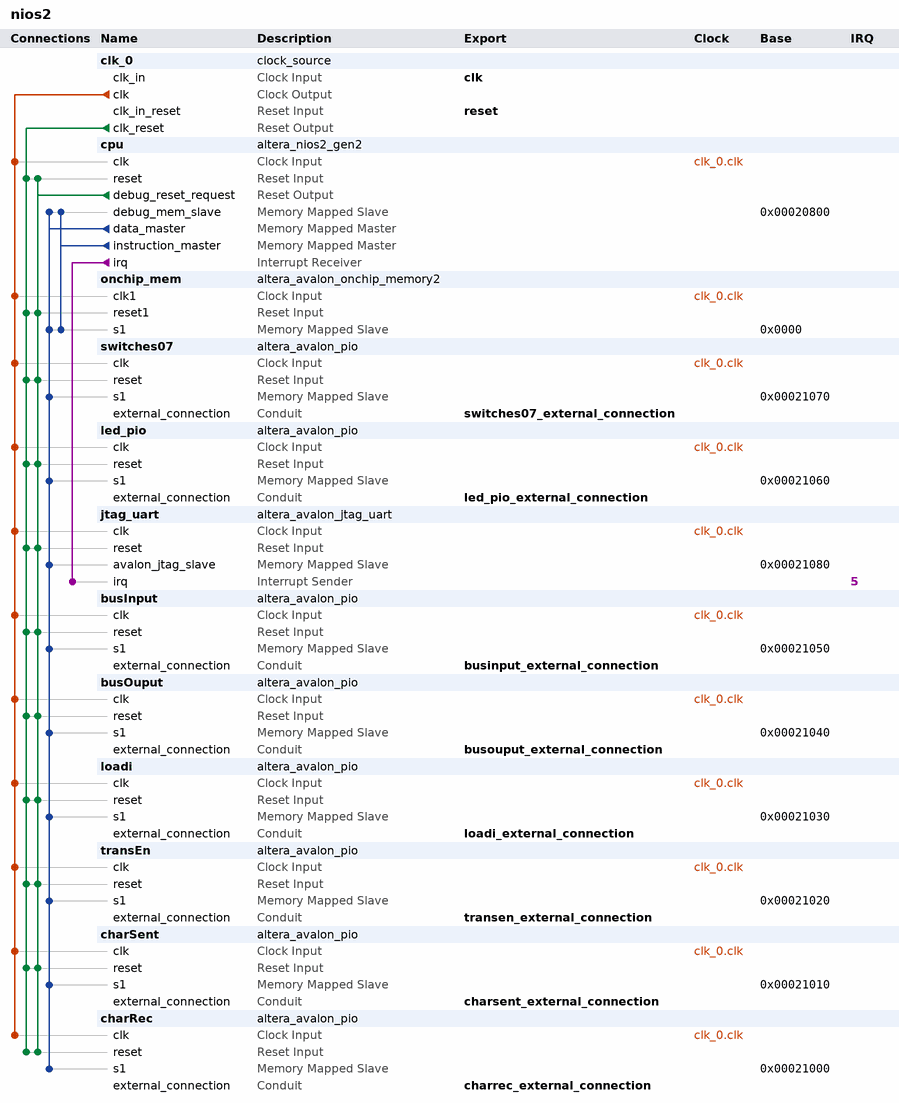
[diagram p0: system contents]
# Platform Designer (Qsys) system nios2, Cyclone V 5CSEMA5F31C6
# Parameters at their usual value, and those the tool derives, are not listed.
package require -exact qsys 17.1
create_system nios2
set_project_property DEVICE_FAMILY {Cyclone V}
set_project_property DEVICE 5CSEMA5F31C6

add_instance clk_0 clock_source 17.1
set_instance_parameter_value clk_0 clockFrequency 50000000

add_instance cpu altera_nios2_gen2 17.1
set_instance_parameter_value cpu dcache_size 2048
set_instance_parameter_value cpu exceptionSlave onchip_mem.s1
set_instance_parameter_value cpu icache_size 2048
set_instance_parameter_value cpu impl Tiny
set_instance_parameter_value cpu resetSlave onchip_mem.s1
set_instance_parameter_value cpu setting_activateTrace true

add_instance onchip_mem altera_avalon_onchip_memory2 17.1
set_instance_parameter_value onchip_mem dataWidth 32
set_instance_parameter_value onchip_mem dualPort false
set_instance_parameter_value onchip_mem initMemContent true
set_instance_parameter_value onchip_mem initializationFileName onchip_mem.hex
set_instance_parameter_value onchip_mem memorySize 100000

add_instance switches07 altera_avalon_pio 17.1
set_instance_parameter_value switches07 direction Input
set_instance_parameter_value switches07 width 8

add_instance led_pio altera_avalon_pio 17.1
set_instance_parameter_value led_pio direction Output
set_instance_parameter_value led_pio width 8

add_instance jtag_uart altera_avalon_jtag_uart 17.1
set_instance_parameter_value jtag_uart simInteractiveOptions NO_INTERACTIVE_WINDOWS

add_instance busInput altera_avalon_pio 17.1
set_instance_parameter_value busInput direction Input
set_instance_parameter_value busInput width 8

add_instance busOuput altera_avalon_pio 17.1
set_instance_parameter_value busOuput direction Output
set_instance_parameter_value busOuput width 8

add_instance loadi altera_avalon_pio 17.1
set_instance_parameter_value loadi direction Output
set_instance_parameter_value loadi width 1

add_instance transEn altera_avalon_pio 17.1
set_instance_parameter_value transEn direction Output
set_instance_parameter_value transEn width 1

add_instance charSent altera_avalon_pio 17.1
set_instance_parameter_value charSent direction Input
set_instance_parameter_value charSent width 1

add_instance charRec altera_avalon_pio 17.1
set_instance_parameter_value charRec direction Input
set_instance_parameter_value charRec width 1

# connections
add_connection clk_0.clk busInput.clk clock
add_connection clk_0.clk busOuput.clk clock
add_connection clk_0.clk charRec.clk clock
add_connection clk_0.clk charSent.clk clock
add_connection clk_0.clk cpu.clk clock
add_connection clk_0.clk jtag_uart.clk clock
add_connection clk_0.clk led_pio.clk clock
add_connection clk_0.clk loadi.clk clock
add_connection clk_0.clk onchip_mem.clk1 clock
add_connection clk_0.clk switches07.clk clock
add_connection clk_0.clk transEn.clk clock
add_connection clk_0.clk_reset busInput.reset reset
add_connection clk_0.clk_reset busOuput.reset reset
add_connection clk_0.clk_reset charRec.reset reset
add_connection clk_0.clk_reset charSent.reset reset
add_connection clk_0.clk_reset cpu.reset reset
add_connection clk_0.clk_reset jtag_uart.reset reset
add_connection clk_0.clk_reset led_pio.reset reset
add_connection clk_0.clk_reset loadi.reset reset
add_connection clk_0.clk_reset onchip_mem.reset1 reset
add_connection clk_0.clk_reset switches07.reset reset
add_connection clk_0.clk_reset transEn.reset reset
add_connection cpu.debug_reset_request busInput.reset reset
add_connection cpu.debug_reset_request busOuput.reset reset
add_connection cpu.debug_reset_request charRec.reset reset
add_connection cpu.debug_reset_request charSent.reset reset
add_connection cpu.debug_reset_request cpu.reset reset
add_connection cpu.debug_reset_request jtag_uart.reset reset
add_connection cpu.debug_reset_request led_pio.reset reset
add_connection cpu.debug_reset_request loadi.reset reset
add_connection cpu.debug_reset_request onchip_mem.reset1 reset
add_connection cpu.debug_reset_request switches07.reset reset
add_connection cpu.debug_reset_request transEn.reset reset
add_connection cpu.data_master busInput.s1 avalon
set_connection_parameter_value cpu.data_master/busInput.s1 baseAddress 0x00021050
add_connection cpu.data_master busOuput.s1 avalon
set_connection_parameter_value cpu.data_master/busOuput.s1 baseAddress 0x00021040
add_connection cpu.data_master charRec.s1 avalon
set_connection_parameter_value cpu.data_master/charRec.s1 baseAddress 0x00021000
add_connection cpu.data_master charSent.s1 avalon
set_connection_parameter_value cpu.data_master/charSent.s1 baseAddress 0x00021010
add_connection cpu.data_master cpu.debug_mem_slave avalon
set_connection_parameter_value cpu.data_master/cpu.debug_mem_slave baseAddress 0x00020800
add_connection cpu.data_master jtag_uart.avalon_jtag_slave avalon
set_connection_parameter_value cpu.data_master/jtag_uart.avalon_jtag_slave baseAddress 0x00021080
add_connection cpu.data_master led_pio.s1 avalon
set_connection_parameter_value cpu.data_master/led_pio.s1 baseAddress 0x00021060
add_connection cpu.data_master loadi.s1 avalon
set_connection_parameter_value cpu.data_master/loadi.s1 baseAddress 0x00021030
add_connection cpu.data_master onchip_mem.s1 avalon
set_connection_parameter_value cpu.data_master/onchip_mem.s1 baseAddress 0x0000
add_connection cpu.data_master switches07.s1 avalon
set_connection_parameter_value cpu.data_master/switches07.s1 baseAddress 0x00021070
add_connection cpu.data_master transEn.s1 avalon
set_connection_parameter_value cpu.data_master/transEn.s1 baseAddress 0x00021020
add_connection cpu.instruction_master cpu.debug_mem_slave avalon
set_connection_parameter_value cpu.instruction_master/cpu.debug_mem_slave baseAddress 0x00020800
add_connection cpu.instruction_master onchip_mem.s1 avalon
set_connection_parameter_value cpu.instruction_master/onchip_mem.s1 baseAddress 0x0000
add_connection cpu.irq jtag_uart.irq interrupt
set_connection_parameter_value cpu.irq/jtag_uart.irq irqNumber 5

# exported interfaces
add_interface businput_external_connection conduit end
set_interface_property businput_external_connection EXPORT_OF busInput.external_connection
add_interface busouput_external_connection conduit end
set_interface_property busouput_external_connection EXPORT_OF busOuput.external_connection
add_interface charrec_external_connection conduit end
set_interface_property charrec_external_connection EXPORT_OF charRec.external_connection
add_interface charsent_external_connection conduit end
set_interface_property charsent_external_connection EXPORT_OF charSent.external_connection
add_interface clk clock sink
set_interface_property clk EXPORT_OF clk_0.clk_in
add_interface led_pio_external_connection conduit end
set_interface_property led_pio_external_connection EXPORT_OF led_pio.external_connection
add_interface loadi_external_connection conduit end
set_interface_property loadi_external_connection EXPORT_OF loadi.external_connection
add_interface reset reset sink
set_interface_property reset EXPORT_OF clk_0.clk_in_reset
add_interface switches07_external_connection conduit end
set_interface_property switches07_external_connection EXPORT_OF switches07.external_connection
add_interface transen_external_connection conduit end
set_interface_property transen_external_connection EXPORT_OF transEn.external_connection

set_interconnect_requirement {$system} qsys_mm.clockCrossingAdapter AUTO
set_interconnect_requirement {$system} qsys_mm.insertDefaultSlave FALSE
set_interconnect_requirement {$system} qsys_mm.maxAdditionalLatency 1

save_system nios2.qsys
